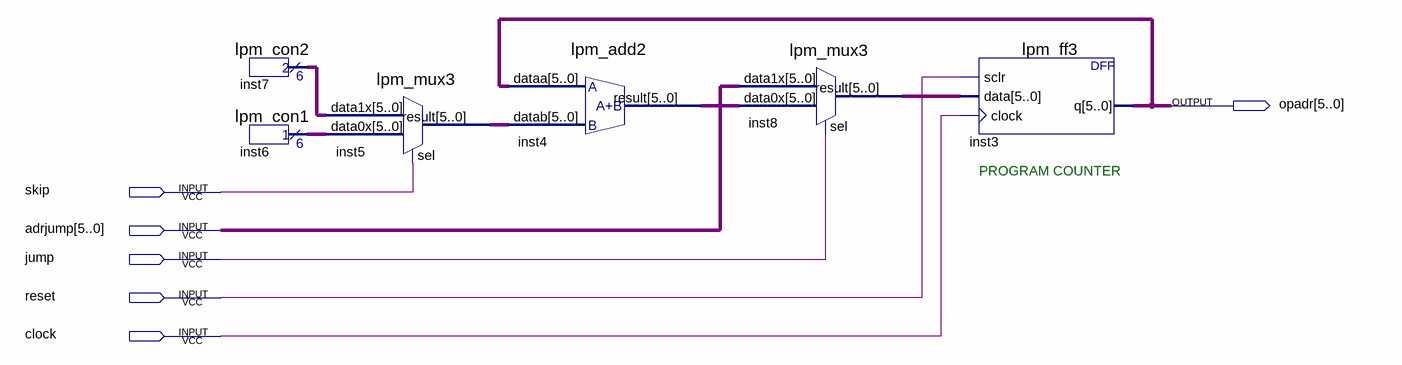
[diagram p0: schematic sheet]
// Quartus schematic ProgCnt.bdf as structural Verilog: 6 symbols, 6 pins
module ProgCnt (
  input  skip,
  input  [5:0] adrjump,
  input  jump,
  input  reset,
  input  clock,
  output [5:0] opadr
);

  wire [5:0] inst4_result, inst5_result, inst6_result, inst7_result, inst8_result;

  lpm_con2 inst7 (.result(inst7_result));
  lpm_con1 inst6 (.result(inst6_result));
  lpm_mux3 inst5 (.data1x(inst7_result), .data0x(inst6_result), .sel(skip), .result(inst5_result));
  lpm_add2 inst4 (.dataa(opadr), .datab(inst5_result), .result(inst4_result));
  lpm_mux3 inst8 (.data1x(adrjump), .data0x(inst4_result), .sel(jump), .result(inst8_result));
  lpm_ff3 inst3 (.sclr(reset), .data(inst8_result), .clock(clock), .q(opadr));

  // Notes on the sheet:
  //   PROGRAM COUNTER
endmodule
